# EAGLE design keyDuino v5 rev1 (EAGLE 7.4.0)
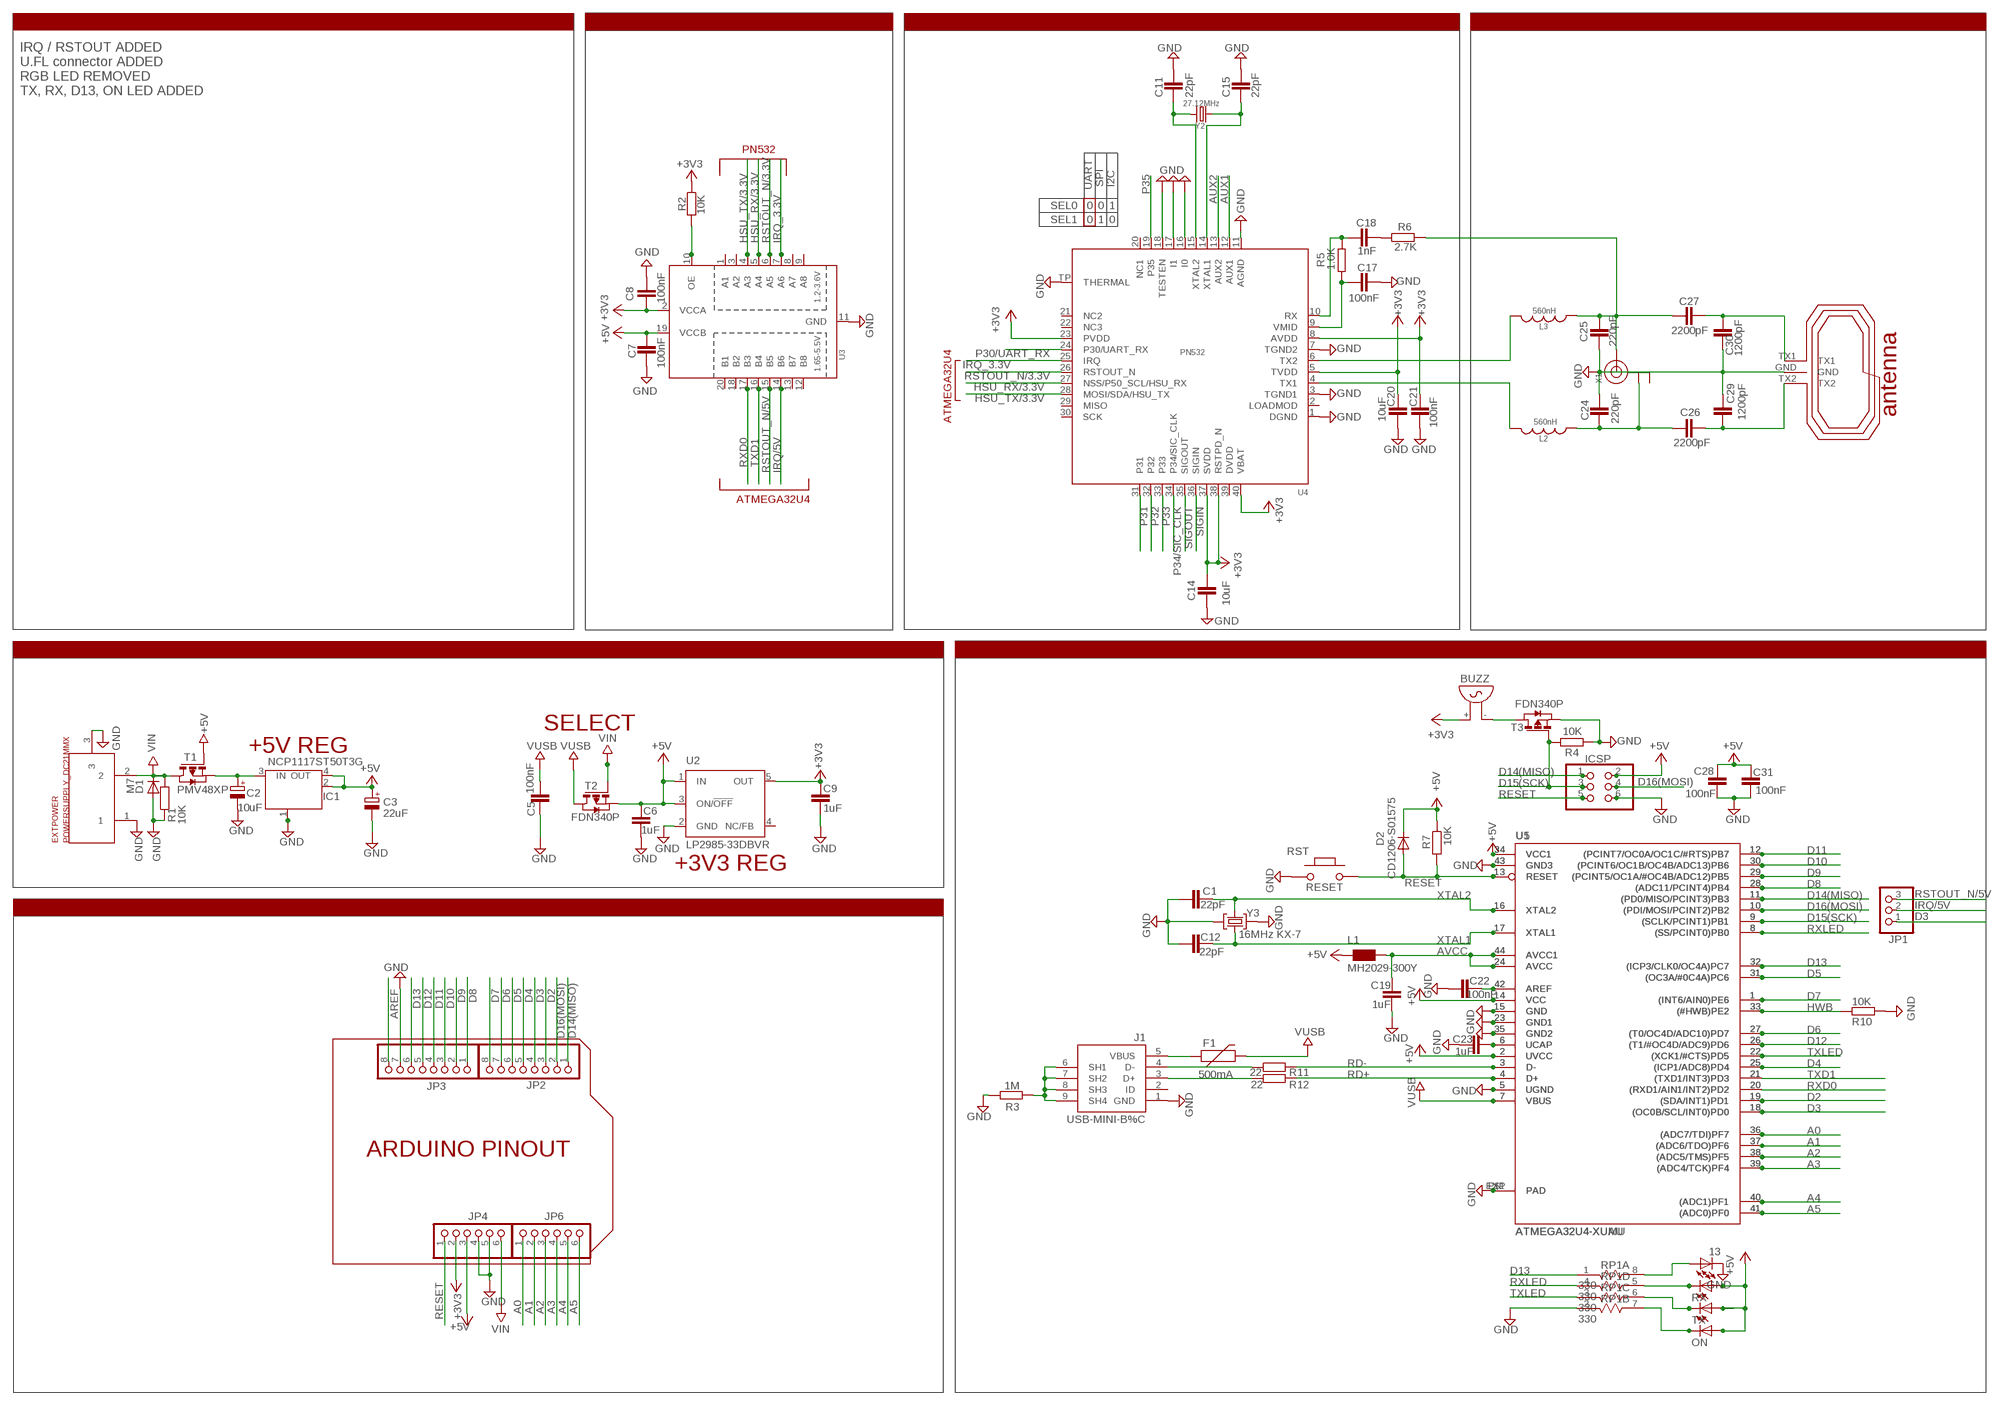
[diagram p0: schematic, sheet 1]

## Parts
13  LEDCHIPLED_0603  [CHIPLED_0603]
BUZZ  F/QMX  [F/QMX]
C1  22pF  CAP0603-CAP  [0603-CAP]
C2  10uF  CPOL-EUSMCB  [SMC_B]
C3  22uF  CPOL-EUSMCB  [SMC_B]
C5  100nF  C-EUC0603  [C0603]
C6  1uF  C-EUC0603  [C0603]
C7  100nF  C-EUC0603  [C0603]
C8  100nF  C-EUC0603  [C0603]
C9  1uF  C-EUC0603  [C0603]
C11  22pF  CAP0603-CAP  [0603-CAP]
C12  22pF  CAP0603-CAP  [0603-CAP]
C14  10uF  C-EUC0805  [C0805]
C15  22pF  CAP0603-CAP  [0603-CAP]
C17  100nF  C-EUC0603  [C0603]
C18  1nF  C-EUC0603  [C0603]
C19  1uF  C-EUC0603  [C0603]
C20  10uF  C-EUC0805  [C0805]
C21  100nF  C-EUC0805  [C0805]
C22  100nF  C-EUC0603  [C0603]
C23  1uF  C-EUC0603  [C0603]
C24  220pF  C-EUC0603  [C0603]
C25  220pF  C-EUC0603  [C0603]
C26  2200pF  C-EUC0603  [C0603]
C27  2200pF  C-EUC0603  [C0603]
C28  100nF  C-EUC0603  [C0603]
C29  1200pF  C-EUC0603  [C0603]
C30  1200pF  C-EUC0603  [C0603]
C31  100nF  C-EUC0603  [C0603]
D1  M7  DIODE-SMB  [SMB]
D2  CD1206-S01575  DIODE-MINIMELF  [MINIMELF]
EXTPOWER  POWERSUPPLY_DC21MMX  [POWERSUPPLY_DC-21MM]
F1  500mA  PTCSMD  [PTC-1206]
IC1  NCP1117ST50T3G  MC33269ST-3.3T3  [SOT223]
ICSP  ICSP  PINHD-2X3  [2X03]
J1  USB-MINI-B%C  [USB-MINI-B_2]
JP1  PINHD-1X3  [1X03]
JP2  PINHD-1X8CLEANBIG  [1X08-CLEANBIG]
JP3  PINHD-1X8CLEANBIG  [1X08-CLEANBIG]
JP4  PINHD-1X6CB  [1X06-CLEANBIG]
JP6  PINHD-1X6CB  [1X06-CLEANBIG]
L1  MH2029-300Y  WE-CBF_0805  [0805]
L2  560nH  INDUCTOR0805  [0805@1]
L3  560nH  INDUCTOR0805  [0805@1]
ON  LEDCHIPLED_0603  [CHIPLED_0603]
R1  10K  R-EU_R0603  [R0603]
R2  10K  R-EU_R0603  [R0603]
R3  1M  R-EU_R0805  [R0805]
R4  10K  R-EU_R0603  [R0603]
R5  1.0K  R-EU_R0603  [R0603]
R6  2.7K  R-EU_R0603  [R0603]
R7  10K  R-EU_R0603  [R0603]
R10  10K  R-EU_R0603  [R0603]
R11  22  R-EU_R0603  [R0603]
R12  22  R-EU_R0603  [R0603]
RP1  330  RES4NT  [RES4NT]
RST  RESET  PB157  [157SW]
RX  LEDCHIPLED_0603  [CHIPLED_0603]
T1  PMV48XP  PMOSSOT23  [SOT-23]
T2  FDN340P  PMOSSOT23  [SOT-23]
T3  FDN340P  PMOSSOT23  [SOT-23]
TX  LEDCHIPLED_0603  [CHIPLED_0603]
U1  ATMEGA32U4-XUAU  [TQFP44-PAD]
U2  LP2985-33DBVR  LP2985-XXDBVR33  [SOT23-DBV]
U3  TXB0108PWR  [TSSOP20]
U4  PN532  [HVQFN40-6X6]
U5  ATMEGA32U4-XUMU  [QFN44ML7X7]
U$1  ANT_V3  [ANT_13.56_P4]
X1  ANTENNA_U.FL  [U.FL]
Y2  27.12MHz  CRYSTALTHIN  [CRYSTAL_3.2X2.5]
Y3  16MHz KX-7  CRYSTAL-3.2-2.5  [CRYSTAL-3.2-2.5]

## Nets
+3V3: BUZZ.+ C8.1 C9.2 C14.2 C20.2 C21.2 JP4.2 R2.1 U2.5(OUT) U3.2(VCCA) U4.5(TVDD) U4.8(AVDD) U4.23(PVDD) U4.37(SVDD) U4.38(RSTPD_N) U4.40(VBAT)
+5V [usbvcc]: C3.+ C6.2 C7.2 C28.1 C31.1 D2.C IC1.2(OUT) IC1.4(OUT) ICSP.2 JP4.3 L1.1 ON.A R7.1 RX.A T1.3(G) T2.2(S) TX.A U1.2(UVCC) U1.14(VCC) U1.34(VCC1) U2.1(IN) U2.3(ON/!OFF) U3.19(VCCB) U5.2(UVCC) U5.14(VCC) U5.34(VCC1)
A0: JP6.1 U1.36((ADC7/TDI)PF7) U5.36((ADC7/TDI)PF7)
A1: JP6.2 U1.37((ADC6/TDO)PF6) U5.37((ADC6/TDO)PF6)
A2: JP6.3 U1.38((ADC5/TMS)PF5) U5.38((ADC5/TMS)PF5)
A3: JP6.4 U1.39((ADC4/TCK)PF4) U5.39((ADC4/TCK)PF4)
A4: JP6.5 U1.40((ADC1)PF1) U5.40((ADC1)PF1)
A5: JP6.6 U1.41((ADC0)PF0) U5.41((ADC0)PF0)
AREF [aref]: C22.1 JP3.8 U1.42(AREF) U5.42(AREF)
AUX1: U4.12(AUX1)
AUX2: U4.13(AUX2)
AVCC: C19.1 L1.2 U1.24(AVCC) U1.44(AVCC1) U5.24(AVCC) U5.44(AVCC1)
B1: 13.A RP1.8
CON1: C24.2 C26.1 L2.1 X1.1(GND)
D2: JP2.3 U1.19((SDA/INT1)PD1) U5.19((SDA/INT1)PD1)
D3: JP1.1 JP2.4 U1.18((OC0B/SCL/INT0)PD0) U5.18((OC0B/SCL/INT0)PD0)
D4: JP2.5 U1.25((ICP1/ADC8)PD4) U5.25((ICP1/ADC8)PD4)
D5: JP2.6 U1.31((OC3A/#0C4A)PC6) U5.31((OC3A/#0C4A)PC6)
D6: JP2.7 U1.27((T0/OC4D/ADC10)PD7) U5.27((T0/OC4D/ADC10)PD7)
D7: JP2.8 U1.1((INT6/AIN0)PE6) U5.1((INT6/AIN0)PE6)
D8: JP3.1 U1.28((ADC11/PCINT4)PB4) U5.28((ADC11/PCINT4)PB4)
D9: JP3.2 U1.29((PCINT5/OC1A/#OC4B/ADC12)PB5) U5.29((PCINT5/OC1A/#OC4B/ADC12)PB5)
D10: JP3.3 U1.30((PCINT6/OC1B/OC4B/ADC13)PB6) U5.30((PCINT6/OC1B/OC4B/ADC13)PB6)
D11: JP3.4 U1.12((PCINT7/OC0A/OC1C/#RTS)PB7) U5.12((PCINT7/OC0A/OC1C/#RTS)PB7)
D12: JP3.5 U1.26((T1/#OC4D/ADC9)PD6) U5.26((T1/#OC4D/ADC9)PD6)
D13: JP3.6 RP1.1 U1.32((ICP3/CLK0/OC4A)PC7) U5.32((ICP3/CLK0/OC4A)PC7)
D14(MISO): ICSP.1 JP2.1 U1.11((PD0/MISO/PCINT3)PB3) U5.11((PD0/MISO/PCINT3)PB3)
D15(SCK): ICSP.3 R4.1 T3.3(G) U1.9((SCLK/PCINT1)PB1) U5.9((SCLK/PCINT1)PB1)
D16(MOSI): ICSP.4 JP2.2 U1.10((PDI/MOSI/PCINT2)PB2) U5.10((PDI/MOSI/PCINT2)PB2)
G1: RP1.5 RX.C
GND [Ground]: 13.C C1.1 C2.- C3.- C5.1 C6.1 C7.1 C8.2 C9.1 C11.1 C12.1 C14.1 C15.1 C17.1 C19.2 C20.1 C21.1 C22.2 C23.2 C24.1 C25.2 C28.2 C29.1 C30.2 C31.2 D1.A EXTPOWER.1 EXTPOWER.3 IC1.1(GND/ADJ) ICSP.6 J1.1(GND) JP3.7 JP4.4 JP4.5 R1.1 R3.1 R4.2 R10.2 RP1.2 RST.1 T3.2(S) U1.5(UGND) U1.15(GND) U1.23(GND1) U1.35(GND2) U1.43(GND3) U1.P$1(PAD) U2.2(GND) U3.11(GND) U4.1(DGND) U4.3(TGND1) U4.7(TGND2) U4.11(AGND) U4.16(I0) U4.17(I1) U4.18(TESTEN) U4.TP(THERMAL) U5.5(UGND) U5.15(GND) U5.23(GND1) U5.35(GND2) U5.43(GND3) U5.EXP(PAD) U$1.GND Y3.2(GND) Y3.4(GND)
HSU_RX/3.3V: U3.5(A4) U4.27(NSS/P50_SCL/HSU_RX)
HSU_TX/3.3V: U3.4(A3) U4.28(MOSI/SDA/HSU_TX)
HWB: R10.1 U1.33((#HWB)PE2) U5.33((#HWB)PE2)
IRQ/5V: JP1.2 U3.14(B6)
IRQ_3.3V: U3.7(A6) U4.25(IRQ)
N$1: BUZZ.- T3.1(D)
N$3: F1.1 J1.5(VBUS)
N$4: J1.6(SH1) J1.7(SH2) J1.8(SH3) J1.9(SH4) R3.2
N$8: C18.1 R6.1
N$9: L2.2 U4.4(TX1)
N$10: L3.2 U4.6(TX2)
N$11: ON.C RP1.7
N$14: J1.4(D-) R11.1
N$16: J1.3(D+) R12.1
N$21: C2.+ IC1.3(IN) T1.2(S)
N$23: R2.2 U3.10(OE)
N$47: C15.2 U4.14(XTAL1) Y2.1
N$48: C11.2 U4.15(XTAL2) Y2.2
N$49: C17.2 R5.2 U4.9(VMID)
N$50: C18.2 R5.1 U4.10(RX)
P30/UART_RX: U4.24(P30/UART_RX)
P31: U4.31
P32: U4.32
P33: U4.33
P34/SIC_CLK: U4.34(P34/SIC_CLK)
P35: U4.19(P35)
R1: RP1.6 TX.C
RD+: R12.2 U1.4(D+) U5.4(D+)
RD-: R11.2 U1.3(D-) U5.3(D-)
RESET: D2.A ICSP.5 JP4.1 R7.2 RST.2 U1.13(RESET) U5.13(RESET)
RSTOUT_N/3.3V: U3.6(A5) U4.26(RSTOUT_N)
RSTOUT_N/5V: JP1.3 U3.15(B5)
RXD0: U1.20((RXD1/AIN1/INT2)PD2) U3.17(B3) U5.20((RXD1/AIN1/INT2)PD2)
RXLED: RP1.4 U1.8((SS/PCINT0)PB0) U5.8((SS/PCINT0)PB0)
SIGIN: U4.36(SIGIN)
SIGOUT: U4.35(SIGOUT)
TX1_ANTENNA: C26.2 C29.2 U$1.TX2
TX2_ANTENNA: C27.1 C30.1 U$1.TX1
TXD1: U1.21((TXD1/INT3)PD3) U3.16(B4) U5.21((TXD1/INT3)PD3)
TXLED: RP1.3 U1.22((XCK1/#CTS)PD5) U5.22((XCK1/#CTS)PD5)
UCAP: C23.1 U1.6(UCAP) U5.6(UCAP)
VIN [usbvcc]: D1.C EXTPOWER.2 JP4.6 R1.2 T1.1(D) T2.3(G)
VUSB [usbvcc]: C5.2 F1.2 T2.1(D) U1.7(VBUS) U5.7(VBUS)
XTAL1: C12.2 U1.17(XTAL1) U5.17(XTAL1) Y3.1(C1)
XTAL2: C1.2 U1.16(XTAL2) U5.16(XTAL2) Y3.3(C2)
XX1: C25.1 C27.2 L3.1 R6.2 X1.3(SIGNAL)
Unconnected: J1.2(ID) U2.4(NC/FB) U3.1(A1) U3.3(A2) U3.8(A7) U3.9(A8) U3.12(B8) U3.13(B7) U3.18(B2) U3.20(B1) U4.2(LOADMOD) U4.20(NC1) U4.21(NC2) U4.22(NC3) U4.29(MISO) U4.30(SCK) U4.39(DVDD) U$1.P$4 U$1.P$5 U$1.P$6 U$1.P$7 U$1.P$8 U$1.P$9 U$1.P$10 U$1.P$11 X1.2(GND)

## Notes on the sheet
- MOD | convertisseur de niveau | PN532 | ACCORDING CIRCUIT
- IRQ / RSTOUT ADDED
  U.FL connector ADDED
  RGB LED REMOVED
  TX, RX, D13, ON LED ADDED
- PN532
- UART | SPI | I2C
- SEL0 | 0 | 0 | 1
- SEL1 | 0 | 1 | 0
- ATMEGA32U4
- ATMEGA32U4
- SUPPLYs | ATMEGA32U4
- SELECT
- +5V REG
- +3V3 REG
- PINOUT
- ARDUINO PINOUT

## Library data of the parts
13 ON RX TX = adafruit:LED: LED OSRAM: - CHIPLED LG R971, LG N971, LY N971, LG Q971, LY Q971, LO R971, LY R971 LH N974, LH R974 LS Q976, LO Q976, LY Q976 LO Q996 - Hyper CHIPLED LW Q18S LB Q993, LB Q99A, LB R99A - SideLED LS A670, LO A670, LY A670, LG A670, LP A670 LB A673, LV A673, LT A673, LW A673 LH A674 LY A675 LS A676, LA A676, LO A676, LY A676, LW A676 LS A679, LY A679, LG A679 - Hyper Micro SIDELED® LS Y876, LA Y876, LO Y876, LY Y876 LT Y87S - SmartLED LW L88C, LW L88S LB L89C, LB L89S, LG L890 LS L89K, LO L89K, LY L89K LS L896, LA L896, LO L896, LY L896 - TOPLED LS T670, LO T670, LY T670, LG T670, LP T670 LSG T670, LSP T670, LSY T670, LOP T670, LYG T670 LG T671, LOG T671, LSG T671 LB T673, LV T673, LT T673, LW T673 LH T674 LS T676, LA T676, LO T676, LY T676, LB T676, LH T676, LSB T676, LW T676 LB T67C, LV T67C, LT T67C, LS T67K, LO T67K, LY T67K, LW E67C LS E67B, LA E67B, LO E67B, LY E67B, LB E67C, LV E67C, LT E67C LW T67C LS T679, LY T679, LG T679 LS T770, LO T770, LY T770, LG T770, LP T770 LB T773, LV T773, LT T773, LW T773 LH T774 LS E675, LA E675, LY E675, LS T675 LS T776, LA T776, LO T776, LY T776, LB T776 LHGB T686 LT T68C, LB T68C - Hyper Mini TOPLED® LB M676 - Mini TOPLED Santana® LG M470 LS M47K, LO M47K, LY M47K Source: http://www.osram.convergy.de/
BUZZ = buzzer:F/QMX: BUZZER Source: Buerklin; OC_FARNELL: unknown; OC_NEWARK: unknown
C1 C11 C12 C15 = SparkFun:CAP: Capacitor Standard 0603 ceramic capacitor, and 0.1" leaded capacitor.
C2 C3 = rcl:CPOL-EU: POLARIZED CAPACITOR, European symbol
C5 C19 C22 C23 C28 C31 = resistor:C-EU: CAPACITOR, European symbol
C6-C9 C14 C17 C18 C20 C21 C24-C27 C29 C30 = rcl:C-EU: CAPACITOR, European symbol
D1 D2 = diode:DIODE-: DIODE
EXTPOWER = SmartPrj:POWERSUPPLY_DC21MM
F1 = SparkFun:PTC: Resettable Fuse PTC Resettable Fuse. Spark Fun Electronics SKU : COM-08357
IC1 = linear:MC33269ST*: Adjustable Output Low Dropout Voltage Regulator 800 mA Source: http://www.onsemi.com/pub/Collateral/MC33269-D.PDF
ICSP = SmartPrj:PINHD-2X3: PIN HEADER
J1 = MyCON2:USB-MINI-B
JP1 = adafruit:PINHD-1X3: PIN HEADER
JP2 JP3 = adafruit:PINHD-1X8: PIN HEADER
JP4 JP6 = adafruit:PINHD-1X6: PIN HEADER
L1 = wuerth-elektronik:WE-CBF: SMD EMI Suppression Ferrite Beads - excellent anti-EMI properties - low DCR - impedances till 3000 ohms - rated current up to 6 A
L2 L3 = microbuilder:INDUCTOR: Inductors 0603: 10nH Ceramic Inductor - microwire antenna/RF (Digikey: 712-1434-2-ND) 0805: 560nH Ceramic Inductor - RF (Digikey: 553-1047-1-ND) 1007 (2518 Metric) SMT: 10µH 10% 250mOhm 820mA 1007 Inductor (Digikey: 587-2189-1-ND) 22µH 10% 500mOhm 580mA 1007 Inductor (Digikey: 587-2190-1-ND) 47µH 10% 950mOhm 420mA 1007 Inductor (Digikey: 587-2191-1-ND) 47µH 5% 100mOhm 1A 1008 Inductor (Digikey: 732-1816-1-ND)
R1 = resistor:R-EU_: RESISTOR, European symbol
R2-R7 R10-R12 = rcl:R-EU_: RESISTOR, European symbol
RP1 = MySMD:RES4NT
RST = MySMD:PB157
T1-T3 = zetex:PMOSSOT23: MOS FET
U1 U5 = SmartPrj:ATMEGA32U4-XU
U2 = SmartPrj:LP2985-XXDBVR: ULTRALOW-POWER 50-mA LOW-DROPOUT LINEAR REGULATORS 50-mA Low-Dropout Regulator Source: http://focus.ti.com/lit/ds/symlink/tps77001.pdf
U3 = adafruit:TXB0108PWR: 8-Bit Bi-Directional Level Shifter 1.2V-3.6V (VCCA) to 1.65V-5.5V (VCCB) bi-directional level shifter with auto direction sensing. Max data rate - VCCA 1.8V: 20Mbps (50ns), VCCA 3.3V: 100Mbps (10ns) Digikey: 296-21527-1-ND
U4 = microbuilder:PN532: PN532 - Near Field Communication (NFC) controller Highly integrated transceiver module for contactless communication at 13.56 MHz (14443A/MIFARE, FeliCa, I4443B)
U$1 = CITC_ANTENNE:ANT_V3
X1 = adafruit:ANTENNA_U.FL: U.FL Antenna Connector
Y2 = microbuilder:CRYSTAL: Crystals HC49UP - Surface Mount Crystal 4.0MHz 18pF +/-30ppm Surface Mount Crystal [Digikey: 535-9857-1-ND] 12.0 MHz Surface Mount Crystal [Digikey: 535-9869-6-ND] 25.0 MHz Surface Mount Crystal [Digikey: 535-9078-1-ND] 3.2 x 2.5mm - MEMs SMT Crystal 12.0 MHz 8pF 15ppm 3.2 x 2.5mm Crystal [Digikey: 644-1047-1-ND] 16.0 MHz 8pF 15ppm 3.2 x 2.5mm Crystal [Digikey: 644-1049-1-ND] 16.0 MHz 10pF 10ppm 3.2 x 2.5mm Crystal [Digikey: 644-1100-1-ND] 27.12 MHz 18pF 30ppm 3.2 x 2.5mm Crystal [Digikey: 887-1424-1-ND] 4.9 x 1.8mm - MEMs SMT Crystal 32.768 KHz 12.5pF 20ppm 4.9 x 1.8mm Crystal [Digikey: SE2415CT-ND] Cylinder 32.768KHz Cylinder Crystal
Y3 = SmartPrj:CRYSTAL-3.2-2.5

## Net classes
1 Ground: width 0.61 mm, clearance 0.254 mm
2 +3v3: width 0.61 mm, clearance 0.254 mm
3 usbvcc: width 0.254 mm, drill 0.61 mm, clearance 0.254 mm
4 aref: width 0.254 mm, drill 0.61 mm, clearance 0.254 mm

## Board
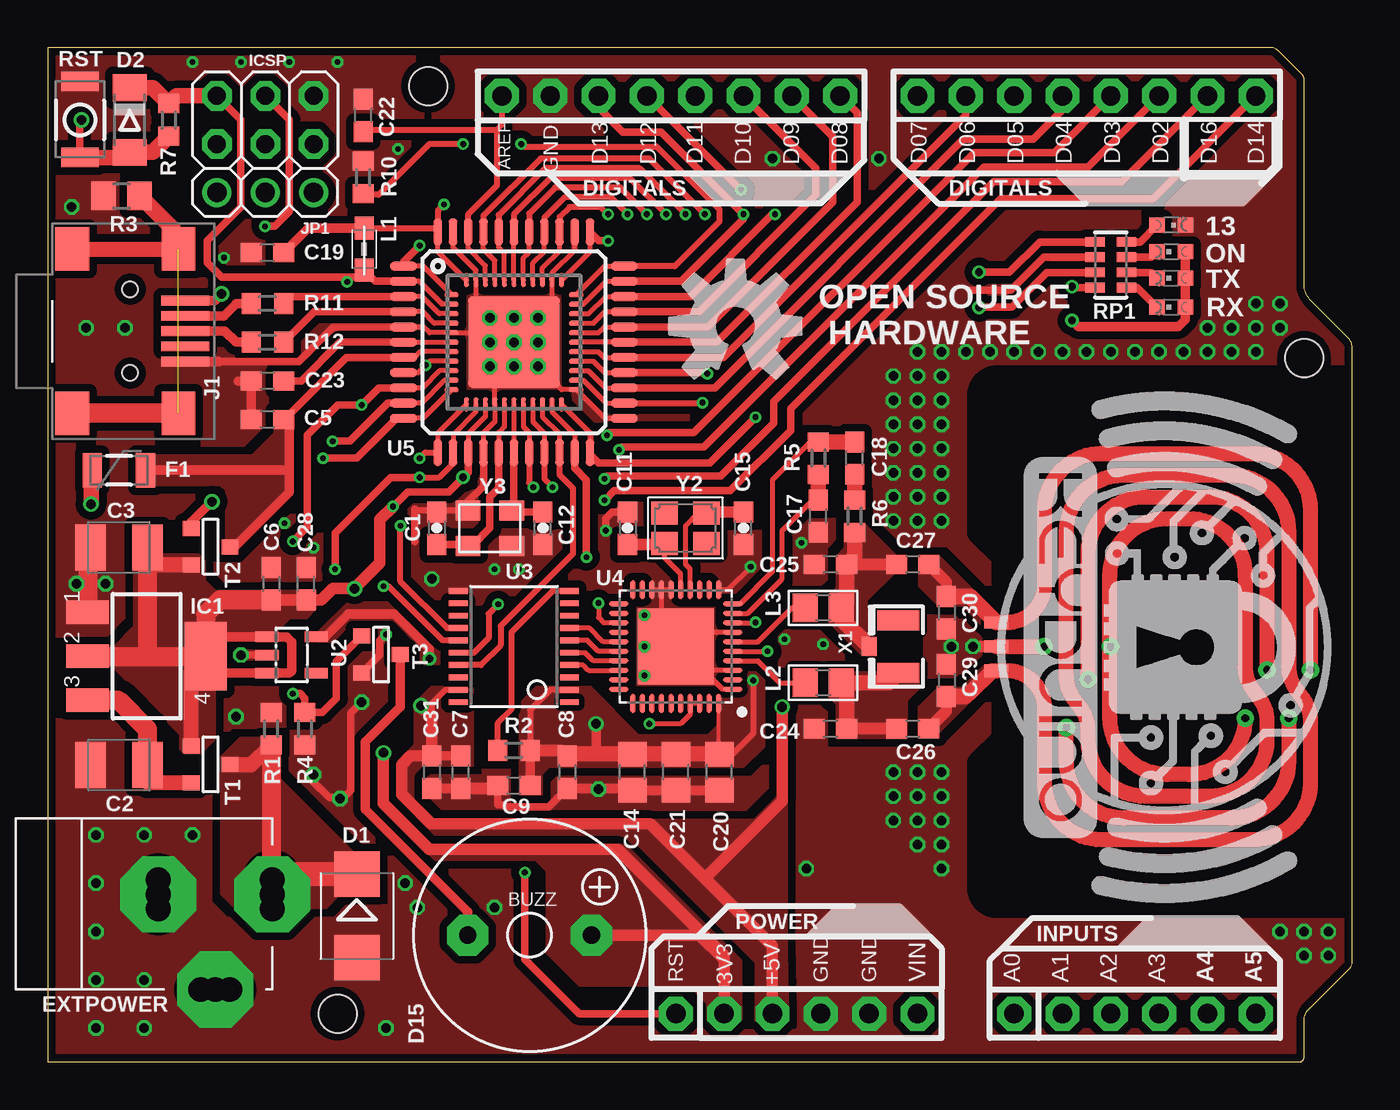
[diagram p1: board, top side]
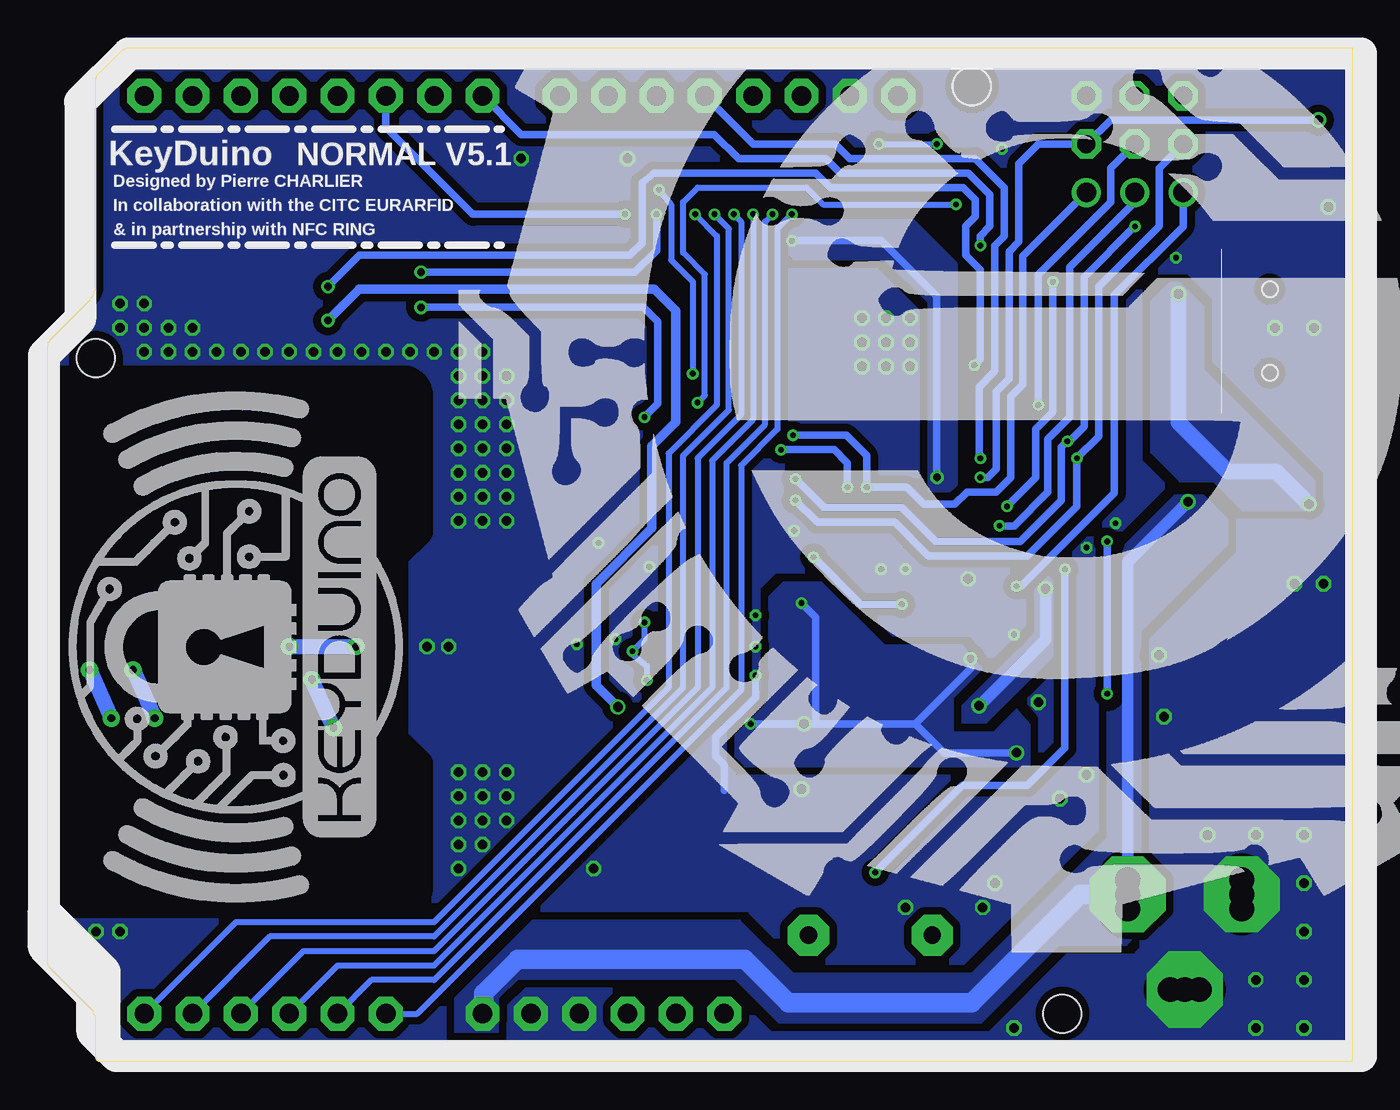
[diagram p2: board, bottom side, seen from below]

Size 68.58 x 53.34 mm. Coordinates in mm from the lower left corner, seen from the top.
Outline: 0,0 65.79,0 arc90 66.04,0.25 66.04,2.21 arc-45 66.28,2.78 68.43,4.93 arc45 68.58,5.29 68.58,37.51 arc45 68.34,38.08 66.42,40.01 arc-45 66.04,40.92 66.04,51.67 arc45 65.93,51.92 64.68,53.17 arc45 64.28,53.34 0,53.34 0,0
Copper layers (1*16): Top 0.035mm / dielectric 1.5mm / Bottom 0.035mm
Design rules "Elecrow_2-layer_eagle_rule": minimum track width 6mil, minimum drill 12mil, track to track 6mil, track to pad 6mil, pad to pad 6mil, via to via 6mil, smd to smd 0mil, copper to edge 10mil, drill to drill 10mil, minimum pad ring 10mil, minimum via ring 6mil, stop-mask expansion 2mil, vias tented up to drill 100mil, thermal gap 10mil
Holes 2 mm at 15.24,2.54 66.04,37.02 20,51.31
tRestrict: area 48.9,8.1 to 68.6,36.1
bRestrict: area 48.9,8.1 to 68.6,36.1

### Footprints (pad centres in the part's own frame; a part is rotated, then mirrored left to right if it is on the bottom)
CHIPLED_0603 = smd 0.8 x 0.8: A 0,-0.75; C 0,0.75
F/QMX = drill 0.914 pad 2.159 octagon: + 3.251,0; - -3.251,0
0603-CAP = smd 1.1 x 1: 1 -0.85,0; 2 0.85,0
SMC_B = smd 1.6 x 2.4: + -1.5,0; - 1.5,0
C0603 = smd 1.1 x 1: 1 -0.85,0; 2 0.85,0
C0805 = smd 1.3 x 1.5: 1 -0.95,0; 2 0.95,0
SMB = smd 2.4 x 2.4: A 2.2,0; C -2.2,0
MINIMELF = smd 1.4 x 1.8: A 1.7,0; C -1.7,0
POWERSUPPLY_DC-21MM = drill 1.3 pad 4 octagon: 1 -5.08,-3.353; 2 -0.076,-6.35; 3 -0.076,-0.356 | drill 1.3: 4 -5.08,-4.115; 5 -5.08,-2.591; 6 -0.838,-0.356; 7 0.686,-0.356; 8 -0.838,-6.35; 9 0.686,-6.35
PTC-1206 = smd 1 x 1.8: 1 -1.4,0; 2 1.4,0
SOT223 = smd 1.219 x 2.235: 1 -2.311,-3.099; 2 0,-3.099; 3 2.311,-3.099 | smd 3.6 x 2.2: 4 0,3.099
2X03 = drill 0.95 pad 1.55 octagon: 1 -2.54,-1.27; 2 -2.54,1.27; 3 0,-1.27; 4 0,1.27; 5 2.54,-1.27; 6 2.54,1.27
USB-MINI-B_2 = smd 0.508 x 2.54: 1 0,0; 2 0.8,0; 3 1.6,0; 4 2.4,0; 5 3.2,0 | smd 2.286 x 1.778: 6 -2.717,5.948; 7 -2.717,0.36; 8 5.918,0.36; 9 5.918,5.948 | hole 0.813: -0.6,2.9; 3.8,2.9
1X03 = drill 1.016: 1 -2.54,0; 2 0,0; 3 2.54,0
1X08-CLEANBIG = drill 1.016 pad 1.778 octagon: 1 -8.89,0; 2 -6.35,0; 3 -3.81,0; 4 -1.27,0; 5 1.27,0; 6 3.81,0; 7 6.35,0; 8 8.89,0
1X06-CLEANBIG = drill 1.016 pad 1.778 octagon: 1 -6.35,0; 2 -3.81,0; 3 -1.27,0; 4 1.27,0; 5 3.81,0; 6 6.35,0
0805 = smd 1.2 x 1: 1 -1.1,0; 2 1.1,0
0805@1 = smd 1.3 x 1.5: 1 -0.95,0; 2 0.95,0
R0603 = smd 1 x 1.1: 1 -0.85,0; 2 0.85,0
R0805 = smd 1.3 x 1.5: 1 -0.95,0; 2 0.95,0
RES4NT = smd 0.508 x 1.016: 1 0,0; 2 0.8,0; 3 1.6,0; 4 2.4,0; 5 2.4,1.651; 6 1.6,1.651; 7 0.8,1.651; 8 0,1.651
157SW = smd 1.016 x 1.981: 1 0,0; 2 4,0
SOT-23 = smd 0.787 x 0.889: 1 0.025,-1.016; 2 -0.94,1.016; 3 0.991,1.016
TQFP44-PAD = smd 1.4 x 0.45: 1 -5.8,4; 2 -5.8,3.2; 3 -5.8,2.4; 4 -5.8,1.6; 5 -5.8,0.8; 6 -5.8,0; 7 -5.8,-0.8; 8 -5.8,-1.6; 9 -5.8,-2.4; 10 -5.8,-3.2; 11 -5.8,-4; 23 5.8,-4; 24 5.8,-3.2; 25 5.8,-2.4; 26 5.8,-1.6; 27 5.8,-0.8; 28 5.8,0; 29 5.8,0.8; 30 5.8,1.6; 31 5.8,2.4; 32 5.8,3.2; 33 5.8,4 | smd 0.45 x 1.4: 12 -4,-5.8; 13 -3.2,-5.8; 14 -2.4,-5.8; 15 -1.6,-5.8; 16 -0.8,-5.8; 17 0,-5.8; 18 0.8,-5.8; 19 1.6,-5.8; 20 2.4,-5.8; 21 3.2,-5.8; 22 4,-5.8; 34 4,5.8; 35 3.2,5.8; 36 2.4,5.8; 37 1.6,5.8; 38 0.8,5.8; 39 0,5.8; 40 -0.8,5.8; 41 -1.6,5.8; 42 -2.4,5.8; 43 -3.2,5.8; 44 -4,5.8 | smd 1 x 1: P$1 0,0
SOT23-DBV = smd 0.55 x 1.2: 1 -0.95,-1.3; 2 0,-1.3; 3 0.95,-1.3; 4 0.95,1.3; 5 -0.95,1.3
TSSOP20 = smd 0.305 x 0.991: 1 -2.925,-2.918; 2 -2.275,-2.918; 3 -1.625,-2.918; 4 -0.975,-2.918; 5 -0.325,-2.918; 6 0.325,-2.918; 7 0.975,-2.918; 8 1.625,-2.918; 9 2.275,-2.918; 10 2.925,-2.918; 11 2.925,2.918; 12 2.275,2.918; 13 1.625,2.918; 14 0.975,2.918; 15 0.325,2.918; 16 -0.325,2.918; 17 -0.975,2.918; 18 -1.625,2.918; 19 -2.275,2.918; 20 -2.925,2.918
HVQFN40-6X6 = smd 1 x 0.25: 1 -2.99,2.25; 2 -2.99,1.75; 3 -2.99,1.25; 4 -2.99,0.75; 5 -2.99,0.25; 6 -2.99,-0.25; 7 -2.99,-0.75; 8 -2.99,-1.25; 9 -2.99,-1.75; 10 -2.99,-2.25; 21 2.99,-2.25; 22 2.99,-1.75; 23 2.99,-1.25; 24 2.99,-0.75; 25 2.99,-0.25; 26 2.99,0.25; 27 2.99,0.75; 28 2.99,1.25; 29 2.99,1.75; 30 2.99,2.25 | smd 0.25 x 1: 11 -2.25,-2.99; 12 -1.75,-2.99; 13 -1.25,-2.99; 14 -0.75,-2.99; 15 -0.25,-2.99; 16 0.25,-2.99; 17 0.75,-2.99; 18 1.25,-2.99; 19 1.75,-2.99; 20 2.25,-2.99; 31 2.25,2.99; 32 1.75,2.99; 33 1.25,2.99; 34 0.75,2.99; 35 0.25,2.99; 36 -0.25,2.99; 37 -0.75,2.99; 38 -1.25,2.99; 39 -1.75,2.99; 40 -2.25,2.99 | smd 4 x 4: TP 0,0
QFN44ML7X7 = smd 0.75 x 0.275: 1 -3.275,2.5; 2 -3.275,2; 3 -3.275,1.5; 4 -3.275,1; 5 -3.275,0.5; 6 -3.275,0; 7 -3.275,-0.5; 8 -3.275,-1; 9 -3.275,-1.5; 10 -3.275,-2; 11 -3.275,-2.5; 23 3.275,-2.5; 24 3.275,-2; 25 3.275,-1.5; 26 3.275,-1; 27 3.275,-0.5; 28 3.275,0; 29 3.275,0.5; 30 3.275,1; 31 3.275,1.5; 32 3.275,2; 33 3.275,2.5 | smd 0.275 x 0.75: 12 -2.5,-3.275; 13 -2,-3.275; 14 -1.5,-3.275; 15 -1,-3.275; 16 -0.5,-3.275; 17 0,-3.275; 18 0.5,-3.275; 19 1,-3.275; 20 1.5,-3.275; 21 2,-3.275; 22 2.5,-3.275; 34 2.5,3.275; 35 2,3.275; 36 1.5,3.275; 37 1,3.275; 38 0.5,3.275; 39 0,3.275; 40 -0.5,3.275; 41 -1,3.275; 42 -1.5,3.275; 43 -2,3.275; 44 -2.5,3.275 | smd 4.826 x 4.826: EXP 0,0
ANT_13.56_P4 = smd 0.635 x 1.27: GND 0,-9; TX1 -1.27,-9; TX2 1.27,-9 | drill 0.4 pad 0.813: P$4 1.23,7.51; P$5 3.77,6.367; P$6 1.23,5.224; P$7 3.77,4.081; P$8 1.73,-4.174; P$9 4.27,-5.317; P$10 0,-3; P$11 0,-6.5
U.FL = smd 2.2 x 1.05: 1 0,1.375; 2 0,-1.375 | smd 0.8 x 1: 3 1.525,0
CRYSTAL_3.2X2.5 = smd 1.4 x 1.2: 1 -1.1,-0.8; 2 1.1,0.8; GND1 -1.1,0.8; GND2 1.1,-0.8
CRYSTAL-3.2-2.5 = smd 1.3 x 1.05: 1 -1.15,-0.925; 2 1.15,-0.925; 3 1.15,0.925; 4 -1.15,0.925

### Placement (x,y rotation side)
13  59.06,44.01 270 top
BUZZ  25.34,6.67 0 top
C1  20.45,28.07 270 top
C2  3.75,15.62 180 top
C3  3.75,27.05 180 top
C5  11.56,33.78 0 top
C6  11.75,25.15 270 top
C7  21.72,15.24 90 top
C8  27.31,15.24 270 top
C9  24.51,14.54 0 top
C11  30.48,28.07 270 top
C12  26.03,28.07 90 top
C14  30.73,15.24 90 top
C15  36.58,28.07 90 top
C17  40.51,28.7 90 top
C18  42.42,31.75 90 top
C19  11.56,42.55 180 top
C20  35.31,15.24 90 top
C21  33.02,15.24 90 top
C22  16.6,49.78 90 top
C23  11.56,35.81 180 top
C24  41.15,17.53 0 top
C25  41.15,26.16 180 top
C26  45.47,17.53 0 top
C27  45.47,26.16 180 top
C28  13.59,25.15 90 top
C29  47.24,20.07 270 top
C30  47.24,23.62 270 top
C31  20.19,15.24 270 top
D1  16.26,7.68 270 top
D2  4.32,49.53 270 top
EXTPOWER  5.46,8.89 90 top
F1  3.75,31.11 0 top
IC1  5.21,21.34 270 top
ICSP  11.44,49.53 0 top
J1  7.24,36.83 90 top
JP1  11.44,45.72 180 top
JP2  54.61,50.8 180 top
JP3  32.77,50.8 180 top
JP4  39.37,2.54 0 top
JP6  57.15,2.54 0 top
L1  16.64,42.74 90 top
L2  40.77,19.94 180 top
L3  40.77,23.88 180 top
ON  59.06,42.61 90 top
R1  11.75,17.53 270 top
R2  24.51,16.38 180 top
R3  3.89,45.54 0 top
R4  13.53,17.53 270 top
R5  40.51,31.75 270 top
R6  42.42,28.7 270 top
R7  6.38,49.53 270 top
R10  16.59,46.51 90 top
R11  11.56,39.88 0 top
R12  11.56,37.85 0 top
RP1  55.05,43.12 270 top
RST  1.7,51.56 270 top
RX  59.06,39.69 90 top
T1  8.57,15.62 90 top
T2  8.57,27.06 90 top
T3  17.53,21.4 90 top
TX  59.06,41.21 90 top
U1  24.51,37.85 0 top
U2  12.83,21.4 270 top
U3  24.51,21.84 90 top
U4  33.02,21.84 180 top
U5  24.51,37.85 0 top
U$1  58.86,21.84 270 top
U$2  [OSHW-LOGO-L]  36.15,38.69 0 top
X1  44.7,21.84 180 top
Y2  33.53,28.07 180 top
Y3  23.24,28.07 180 top

### Tracks (layer width: path | path; a pad name or v marks a point on that pad's centre or on a via)
+3V3  (via drill 0.3, 0.4, 0.5)
  Top 0.2: C20.2 35.27,15.98 U4.40
  Top 0.254: U4.23 29.23,23.09 28.96,23.37 v28.96,24.13 | v31.62,17.78 33.27,17.78 33.77,18.27 U4.37 U4.38 | U4.5 v37.84,21.59 v37.85,21.59 | U4.8 37.32,23.09 v37.21,23.11
  Top 0.305: U3.2 26.43,19.57 25.36,18.5 R2.1 | v37.08,20.07 37.08,17.27 36,16.19 C20.2 | v37.85,21.59 37.97,21.59 | C8.1 27.31,16.19 27.41,16.19
  Top 0.5: C9.2 R2.1 | C8.1 27.14,16 | v28.83,17.78 28.83,16.19 | v20.07,21.21 20.07,21.72 18.22,23.56 15.81,23.56 14.6,22.35 U2.5
  Top 0.61: 35.56,5.4 35.56,5.59 29.97,11.18 20.07,11.18 17.65,13.59 v17.65,16.26 | R2.1 27.01,16.38 C8.1 | BUZZ.+ 34.29,6.67 35.56,5.4 | JP4.2 35.56,5.4
  Top 0.813: 27.41,16.19 28.83,16.19 C14.2 C21.2 C20.2
  Bottom 0.305: v37.08,20.07 37.08,20.83 37.72,21.34 37.97,21.6 v37.84,21.59 37.21,22.22 v37.21,23.11
  Bottom 0.406: 22.99,17.78 28.19,17.78 | 28.19,17.78 v28.83,17.78 v31.62,17.78 | v28.96,24.13 28.19,23.37 28.19,17.78 | v20.07,21.21 20.07,20.7 22.99,17.78 | v17.65,16.26 21.46,16.26 22.99,17.78
  pour Top (isolate 0.305, no thermals): 24.83,14.03 24.83,18.86 25.72,19.75 28.51,19.75 31.05,17.21 34.73,17.21 35.24,17.72 35.24,19.18 35.31,20.51 37.34,20.51 37.66,20.19 37.66,16.57 36.58,15.49 26.35,15.49 25.97,15.11 25.97,14.03
  pour Top (isolate 0.305, no thermals): 34.67,2.22 34.67,3.05 33.72,4 27.94,4 26.23,5.72 26.23,10.03 25.65,10.6 20.38,10.6 19.62,11.37 20.19,11.43 30.35,11.43 36.45,5.33 36.45,2.22
  pour Top (isolate 0.406, no thermals): 14.16,22.54 15.81,24.19 18.54,24.19 20.57,22.16 20.57,20.89 19.81,20.89 19.62,21.08 19.62,21.78 18.16,23.24 16.13,23.24 14.99,22.1 14.16,22.1
  pour Bottom (isolate 0.406, rank 2, no thermals): 16.95,15.56 16.95,17.72 20.51,21.91 24.57,21.91 27.88,25.21 29.91,25.21 30.67,24.45 30.67,19.11 32.45,17.34 32.45,16.07 31.94,15.56
+5V  (via drill 0.3, 0.4, 0.5)
  Top 0.254: U5.14 23.01,33.93 22.11,33.03 U1.14 | U5.34 28.51,42.62 U1.34 | U5.2 20.73,39.85 19.53,41.05 U1.2
  Top 0.305: U3.19 20.9,19.57 20.19,18.86 C31.1
  Top 0.406: U1.34 28.98,43.18 v29.46,43.18 | 22.1,32.03 U1.14 22.11,31 v21.84,30.73 21.08,29.97 18.92,29.97 v18.16,29.21 | ICSP.2 10.16,49.54 10.16,44.96 8.38,43.18 8.38,42.04 9.14,41.28 16.28,41.28 L1.1 | U1.2 17.23,41.05 17.01,41.26 | 17.01,41.26 L1.1 | 16.62,41.64 L1.1 | v15.75,41.02 15.99,41.26 17.01,41.26
  Top 0.5: C31.1 C7.2 | ON.A TX.A RX.A 59.81,39.04 59.44,38.67 54.17,38.67 v53.85,38.99 | 8.7,21.78 9.27,22.35 U2.1 12.58,22.35 12.83,22.1 12.83,20.57 12.7,20.45 U2.3 9.19,20.45 IC1.4
  Top 0.61: C6.2 C28.1 14.39,24.3 14.99,24.89 v16.13,24.89 17.46,26.23 17.46,28.51 v18.16,29.21 | JP4.3 38.1,6.1 34.54,9.65 | 34.54,9.65 31.69,12.51 20.16,12.51 18.61,14.07 18.61,15.63 19.07,16.09 C31.1 20.19,18.16 v19.62,18.73 | v38.61,18.67 38.61,13.72 34.54,9.65
  Top 0.8: T2.2 5.25,26.12 C3.+ | T1.3 7.56,20.59 IC1.4
  Top 0.813: D2.C 5.53,51.23 R7.1 6.8,50.8 ICSP.2
  Top 1: IC1.2 4.95,21.34 | 4.95,21.34 IC1.4 8.31,23.55 9.06,24.3 C6.2 | C3.+ 5.25,21.63 arc-90 4.95,21.34
  Bottom 0.406: v15.75,41.02 15.75,34.16 16.64,33.27 16.64,30.73 v18.16,29.21 | v29.46,43.18 24.76,43.18 21.84,40.26 v21.84,30.73
  Bottom 0.5: v38.61,18.67 39.75,19.81 39.75,25.15 36.83,28.07 36.83,32.39 35.56,33.66 35.56,39.5 36.7,40.64 52.2,40.64 v53.85,38.99
  Bottom 0.61: v16.13,24.89 16.13,22.22 v19.62,18.73
  pour Top (isolate 0.61, no thermals): 1.08,21.91 3.49,21.91 4.51,22.92 4.51,26.48 4.76,26.73 7.94,26.73 8.32,26.35 8.32,25.34 8.83,24.83 14.16,24.83 14.16,23.81 13.65,23.3 12.76,23.3 11.62,22.16 8.83,22.16 8.83,16.95 8.06,16.19 7.18,16.19 6.92,16.45 6.92,17.21 3.37,20.76 1.08,20.76
  pour Top (isolate 0.406, no thermals): 37.21,2.16 37.21,5.21 30.99,11.43 20.7,11.43 18.45,13.72 18.41,15.8 19.3,16.7 19.3,18.86 20.19,19.75 22.22,19.75 22.35,19.62 22.35,15.56 19.69,15.56 19.43,15.3 19.43,13.65 20.32,12.76 37.15,12.76 38.29,13.91 38.86,13.91 38.86,5.84 38.93,2.22 38.86,2.16
  pour Bottom (isolate 0.406, no thermals): 15.68,25.21 15.94,25.46 16.45,25.46 16.7,25.21 16.7,22.54 20.51,18.73 20.51,17.84 19.24,17.84 15.68,21.4
  pour Bottom (isolate 0.406, no thermals): 22.29,29.78 21.27,29.78 20.76,30.29 20.76,41.97 23.05,44.26 29.15,44.26 29.91,43.5 29.91,42.74 29.4,42.23 24.57,42.23 22.29,39.94
A0  (via drill 0.3)
  Top 0.254: U5.36 26.01,41.76 26.91,42.66 U1.36
  Top 0.305: v29.46,44.58 29.08,44.96 27.43,44.96 26.91,44.44 U1.36
  Bottom 0.305: v29.46,44.58 30.23,43.81 30.23,33.27 32.13,31.37 32.13,19.56 49.15,2.54 JP6.1
A1  (via drill 0.3)
  Top 0.254: U5.37 25.51,42.02 26.11,42.62 U1.37
  Top 0.305: v30.48,44.58 29.59,45.47 27.18,45.47 26.11,44.4 U1.37
  Bottom 0.305: JP6.2 51.56,4.32 48.26,4.32 32.89,19.69 32.89,31.5 30.86,33.53 30.86,44.2 v30.48,44.58
A2  (via drill 0.3)
  Top 0.254: U5.38 25.01,42.28 25.31,42.58 U1.38
  Top 0.305: v31.5,44.58 30.1,45.97 26.67,45.97 25.31,44.61 U1.38
  Bottom 0.305: JP6.3 53.34,5.08 48.26,5.08 33.66,19.69 33.66,31.62 31.5,33.78 v31.5,44.58
A3  (via drill 0.3)
  Top 0.254: U5.39 U1.39
  Top 0.305: v32.51,44.58 30.61,46.48 26.42,46.48 24.51,44.58 U1.39
  Bottom 0.305: JP6.4 55.12,5.84 48.26,5.84 34.42,19.69 34.42,31.75 32.13,34.04 32.13,44.2 v32.51,44.58
A4  (via drill 0.3)
  Top 0.254: U5.40 24.01,42.54 23.71,42.84 U1.40
  Top 0.305: v33.53,44.58 31.12,46.99 26.16,46.99 23.71,44.54 U1.40
  Bottom 0.305: JP6.5 56.9,6.6 48.26,6.6 35.18,19.69 35.18,31.88 32.77,34.29 32.77,43.81 v33.53,44.58
A5  (via drill 0.3)
  Top 0.254: U5.41 23.51,42.15 22.91,42.75 U1.41
  Top 0.305: v34.54,44.58 31.62,47.5 25.91,47.5 22.91,44.5 U1.41
  Bottom 0.305: JP6.6 58.67,7.37 48.26,7.37 35.94,19.69 35.94,32 33.4,34.54 33.4,43.43 v34.54,44.58
AREF
  Top 0.254: U5.42 23.01,41.89 22.11,42.79 U1.42
  Top 0.305: U1.42 22.11,44.59 23.62,46.1 23.62,49.02 | C22.1 16.63,49.02 23.62,49.02 | JP3.8 23.88,49.28 23.62,49.02
AVCC  (via drill 0.3)
  Top 0.254: U5.44 20.51,42.62 U1.44 | U5.24 28.16,35.85 29.36,34.65 U1.24
  Top 0.305: U1.24 34.39,34.65 v34.42,34.67 | v20.83,45.09 20.51,44.77 U1.44 20.32,43.84 L1.2
  Top 0.5: C19.1 13.7,43.84 L1.2
  Bottom 0.305: v34.42,34.67 34.04,35.05 34.04,41.4 35.18,42.55 35.18,45.21 34.42,45.97 28.7,45.97 27.81,45.09 v20.83,45.09
B1
  Top 0.406: 13.A 57.42,43.12 RP1.8
CON1
  Top 0.61: C24.2 C26.1
  Top 0.813: X1.1 44.17,19.94 L2.1 42,19.66 C24.2
  pour Top (isolate 0.406, no thermals): 45.15,17.02 41.47,17.02 41.47,18.8 41.08,19.18 41.08,20.51 43.75,20.51 44.07,20.95 45.78,20.95 45.78,19.62 45.15,18.99
D2  (via drill 0.3)
  Top 0.254: U5.19 25.51,33.67 26.11,33.07 U1.19
  Top 0.305: U1.19 26.11,30.66 v26.54,30.23
  Top 0.406: JP2.3 54.67,47.05 49.21,47.05 34.48,32.32 30.16,32.32 v30.04,32.19
  Bottom 0.406: v30.04,32.19 27.24,32.19 26.54,31.5 v26.54,30.23
D3  (via drill 0.3)
  Top 0.254: U5.18 25.01,33.41 25.31,33.11 U1.18
  Top 0.305: U1.18 25.31,30.44 v25.53,30.23
  Top 0.406: JP2.4 52.9,47.82 48.7,47.82 33.97,33.08 29.53,33.08 v29.4,32.96
  Bottom 0.406: v29.4,32.96 26.61,32.96 25.53,31.88 v25.53,30.23 23.43,30.23 22.54,29.34 20.89,29.34 20.26,29.97 18.73,29.97 17.97,30.73 17.97,34.99 17.34,35.62 17.34,42.37 JP1.1
D4
  Top 0.254: U5.25 28.42,36.35 29.32,35.45 U1.25
  Top 0.406: U1.25 35.07,35.45 48.13,48.51 51.82,48.51 53.34,50.04 JP2.5
D5  (via drill 0.3)
  Top 0.254: U5.31 28.42,39.35 29.32,40.25 U1.31
  Top 0.406: U1.31 33.77,40.25 38.1,44.58 v38.23,44.58
  Bottom 0.406: JP2.6 50.8,49.15 46.23,44.58 v38.23,44.58
D6
  Top 0.254: U5.27 28.95,37.35 29.25,37.05 U1.27
  Top 0.406: U1.27 35.52,37.05 48.26,49.78 JP2.7
D7  (via drill 0.3)
  Top 0.254: U5.1 19.74,41.85 U1.1
  Top 0.406: v19.56,42.93 18.71,42.08 U1.1
  Bottom 0.406: JP2.8 43.69,48.77 33.53,48.77 32.26,47.5 27.69,47.5 26.92,46.74 20.19,46.74 19.05,45.59 19.05,43.94 19.56,43.43 v19.56,42.93
D8
  Top 0.254: U1.28 U5.28
  Top 0.406: U1.28 35.18,37.85 42.54,45.21 42.54,49.91 JP3.1
D9
  Top 0.254: U5.29 28.95,38.35 29.25,38.65 U1.29
  Top 0.406: U1.29 34.71,38.65 41.28,45.21 41.28,48.64 JP3.2
D10
  Top 0.254: U5.30 28.69,38.85 29.29,39.45 U1.30
  Top 0.406: U1.30 34.24,39.45 40.39,45.59 40.39,46.99 JP3.3
D11  (via drill 0.3)
  Top 0.254: U5.12 20.51,33.07 U1.12
  Top 0.305: v19.56,31.75 19.85,32.05 U1.12
  Bottom 0.406: JP3.4 31.5,48.26 27.18,48.26 26.42,47.5 19.81,47.5 18.29,45.97 18.29,43.43 18.8,42.93 18.8,36.32 19.62,35.5 19.62,31.81 v19.56,31.75
D12  (via drill 0.3)
  Top 0.254: U5.26 28.69,36.85 29.29,36.25 U1.26
  Top 0.406: v34.67,36.2 34.6,36.25 U1.26 | JP3.5 v36.45,45.85
  Bottom 0.305: v34.67,36.2 34.67,41.02 35.81,42.16 35.81,45.09 v36.45,45.85
D13  (via drill 0.3, 0.4)
  Top 0.254: U5.32 28.16,39.85 29.36,41.05 U1.32
  Top 0.406: U1.32 33.3,41.05 36.58,44.32 v36.58,44.58 32.26,48.89 30.23,48.89 28.96,50.17 JP3.6 | RP1.1 52.13,43.12 50.55,41.53 v48.96,41.53
  Bottom 0.406: v36.58,44.58 36.58,42.67 37.72,41.53 v48.96,41.53
D14(MISO)  (via drill 0.3)
  Top 0.254: U5.11 19.74,33.85 U1.11
  Top 0.406: 18.48,33.85 U1.11 18.35,33.85 16.26,31.75 v14.48,31.75 | JP2.1 58.1,45.4 50.1,45.4 39.05,34.35 39.05,33.21 35.88,30.04 29.78,30.04 v29.27,29.53
  Bottom 0.406: ICSP.1 10.16,47 10.16,43.94 13.34,40.77 13.34,32.89 v14.48,31.75 14.48,29.21 17.08,26.61 22.29,26.61 24.07,28.38 28.13,28.38 v29.27,29.53
D15(SCK)  (via drill 0.3)
  Top 0.254: U5.9 20.6,36.35 19.7,35.45 U1.9
  Top 0.406: U1.9 17.41,35.45 v16.51,34.54 15.24,34.54 13.65,32.96 13.65,28.13 v12.89,27.37 | T3.3 15.18,21.06 15.18,19.11 14.44,18.38 R4.1 13.53,19.11 13.27,19.37 v12.89,19.37
  Bottom 0.406: ICSP.3 12.7,47 12.7,45.21 16.51,41.4 v16.51,34.54 | v12.89,19.37 v12.89,27.37
D16(MOSI)  (via drill 0.3)
  Top 0.254: U5.10 20.86,35.85 19.66,34.65 U1.10
  Top 0.406: ICSP.4 12.7,49.54 12.7,44.7 11.94,43.94 v11.43,43.94 | U1.10 17.88,34.65 15.88,32.64 v14.99,32.64 | JP2.2 56.45,46.29 49.72,46.29 38.16,34.73 38.16,33.59 35.37,30.8 29.4,30.8 v29.27,30.67
  Bottom 0.406: v11.43,43.94 14.1,41.28 14.1,33.4 14.86,32.64 v14.99,32.64 15.3,32.32 15.3,29.53 17.46,27.37 21.91,27.37 23.69,29.15 27.75,29.15 v29.27,30.67
G1
  Top 0.406: RX.C 57.28,40.72 RP1.5
GND  (via drill 0.3, 0.5)
  Top 0.254: U1.15 22.91,33.07 23.51,33.67 U5.15 23.51,36.85 U1.P$1 | U1.23 29.29,33.85 U5.23 27.01,35.35 U1.P$1 | U1.5 19.77,38.65 20.07,38.35 U5.5 24.01,38.35 U1.P$1 | U1.43 21.31,42.82 22.51,41.62 U5.43 22.51,39.85 U1.P$1 | U1.35 27.71,42.7 26.51,41.5 U5.35 26.51,39.85 U1.P$1 | U4.3 34.48,20.59 | 34.48,20.59 34.27,20.59 U4.TP | U4.7 33.77,22.59 U4.TP | U4.17 32.27,22.59 U4.TP | U4.18 U4.17 | U4.11 35.76,24.83 v36.96,26.03 | U4.1 35.48,19.59 34.48,20.59 | U4.17 U4.16
  Top 0.305: Y3.2 19.46,28.99
  Top 0.406: C11.1 29.68,28.92 29.34,28.58 v29.34,27.94 | Y3.2 22.09,29.46 22.92,30.29 22.92,32.03 U1.15 | 9.14,36.83 13.21,36.83 15.02,38.65 U1.5 | C8.2 26.34,13.42 24.08,13.42 23.94,13.53 23.69,13.53 23.66,13.55 C9.1 | U2.2 v10.16,21.4 | v16.51,18.92 15.94,18.35 15.94,14.29 15.56,13.91 14.8,13.91 13.97,14.73 v13.97,15.11 | v17.78,22.48 17.46,22.16 17.46,21.4 16.52,20.46 T3.2 | 19.3,29.08 19.3,27.37 | RP1.2 52.35,42.32 50.63,40.6 48.54,40.6
  Top 0.5: C7.1 C31.2 | C20.1 C21.1 C14.1 30.63,14.39 C8.2 | J1.1 9.02,36.83 | 10.03,35.81 C23.2 C5.1
  Top 0.61: U$1.GND v48.64,21.84 | C7.1 23.26,14.39 C9.1
  Top 1: C3.- 2.11,26.91 IC1.1
  Bottom 0.406: 31.37,20.19 31.37,19.18 33.46,17.08 33.46,16.07 33.02,15.62 C21.1
  other vias: 38.1,47.5 17.78,1.78 5.08,1.78 5.08,4.32 2.54,4.32 2.54,1.78 2.54,6.86 2.54,9.4 2.54,11.94 5.08,11.94 7.62,11.94 7.62,52.58 10.16,52.58 12.7,52.58 15.24,52.58 1.27,44.96 24.51,37.85 25.78,39.12 25.78,36.58 23.24,36.58 23.24,39.12 24.51,39.12 25.78,37.85 23.24,37.85 24.51,36.58 31.37,23.5 31.37,21.84 23.5,25.91 9.27,42.29 39.62,27.31 43.69,47.5 28.96,14.35 46.99,34.8 46.99,32.26 46.99,29.72 45.72,30.99 46.99,30.99 44.45,34.8 44.45,33.53 44.45,32.26 44.45,30.99 44.45,29.72 44.45,28.45 45.72,33.53 45.72,32.26 45.72,29.72 45.72,28.45 46.99,28.45 46.99,33.53 57.15,37.34 55.88,37.34 54.61,37.34 50.8,37.34 53.34,37.34 52.07,37.34 45.72,34.8 45.72,36.07 46.99,36.07 49.53,37.34 48.26,37.34 46.99,37.34 45.72,37.34 44.45,36.07 58.42,37.34 59.69,37.34 60.96,37.34 62.23,37.34 63.5,37.34 63.5,38.61 64.77,38.61 62.23,38.61 60.96,38.61 63.5,39.88 64.77,39.88 46.99,15.24 45.72,15.24 44.45,15.24 44.45,13.97 45.72,13.97 46.99,13.97 46.99,12.7 45.72,12.7 44.45,12.7 45.72,11.43 46.99,11.43 46.99,10.16 64.77,6.86 66.04,6.86 67.31,6.86 67.31,5.59 66.04,5.59 1.52,25.15 23.5,8.13 9.91,18.16 24.76,25.91 4.06,38.61 2.03,38.61 39.88,10.16 40.77,21.97 38.73,22.22 31.37,20.32 19.43,8.13 18.41,48.01 3.05,25.15 15.37,13.84 20.19,25.4 13.97,27.05 12.45,28.32 47.5,21.84 18.8,9.4
  pour Bottom (isolate 0.406, rank 3, no thermals): 0,53.47 68.58,53.47 68.58,-0.76 0,-0.76
  pour Top (isolate 0.406, rank 2, no thermals): 0,57.4 68.58,57.4 68.58,-0.76 0,-0.76
  pour Top (isolate 0.406, no thermals): 49.34,22.16 49.21,22.16 48.26,23.11 48.13,23.24 46.8,23.24 46.8,20.45 48.13,20.45 49.21,21.53 49.34,21.53
HSU_RX/3.3V
  Top 0.254: U3.5 28.26,21.52 28.69,21.09 U4.27
HSU_TX/3.3V
  Top 0.254: U3.4 28.15,20.87 28.43,20.59 U4.28
HWB  (via drill 0.3)
  Top 0.254: U5.33 29.29,41.85 U1.33
  Top 0.305: 16.33,45.52 R10.1 16.4,45.59 17.4,45.59 20.07,48.26 v21.84,48.26 | U1.33 32.96,41.85 35.31,44.2 35.31,44.83 32,48.13 25.02,48.13 v24.89,48.26
  Bottom 0.305: v24.89,48.26 v21.84,48.26
IRQ/5V  (via drill 0.3)
  Top 0.305: U3.14 21,22.82 18.54,25.27 v18.54,28.19
  Bottom 0.406: JP1.2 11.44,45.2 14.86,41.78 14.86,33.91 16,32.77 16,29.97 17.78,28.19 v18.54,28.19
IRQ_3.3V
  Top 0.254: U4.25 29.21,22.09 28.49,22.82 U3.7
N$1
  Top 0.5: T3.1 18.54,18.67 16.7,16.83 16.7,13.27 22.09,7.89 BUZZ.-
N$3  (via drill 0.5)
  Top 0.5: J1.5 8.79,40.03 v9.14,40.39
  Top 0.813: F1.1 2.29,31.05 v2.29,29.34
  Bottom 0.813: v2.29,29.34 4,31.05 6.54,31.05 9.14,33.66 v9.14,40.39
  pour Bottom (isolate 0.406, no thermals): 1.97,29.53 1.97,30.54 7.81,36.39 7.81,39.69 9.08,40.96 9.59,40.96 10.6,39.94 10.6,32.07 9.08,30.54 7.3,30.54 5.78,29.02 2.48,29.02
N$4  (1 unrouted)
  Top 0.8: J1.9 1.21,42.92 1.63,42.75 J1.8
  Top 0.813: R3.2 6.63,43.75 J1.8
  Top 1.016: J1.6 J1.7
N$8
  Top 0.813: C18.1 R6.1
N$9
  Top 0.254: U4.4 37.33,21.09 38.48,19.94 L2.2
N$10
  Top 0.254: U4.6 37.33,22.09 39.12,23.88 L3.2
N$11
  Top 0.406: ON.C 58.01,42.32 RP1.7
N$14
  Top 0.5: J1.4 9.26,39.23 9.91,39.88 R11.1
N$16
  Top 0.5: J1.3 9.32,38.43 9.91,37.85 R12.1
N$21
  Top 0.8: T1.2 5.25,14.68 C2.+
  Top 1: IC1.3 3.71,19.02 5.25,17.49 C2.+
N$23
  Top 0.305: U3.10 26.55,24.77 24.38,22.61 24.38,18.54 23.66,17.82 R2.2
N$47
  Top 0.254: U4.14 33.77,25.92 33.53,26.16 33.53,28.19 34.2,28.87 Y2.1
  Top 0.61: C15.2 34.68,28.92 Y2.1
N$48
  Top 0.254: U4.15 33.27,25.66 32.43,26.5 Y2.2
  Top 0.61: C11.2 32.38,27.22 Y2.2
N$49
  Top 0.254: U4.9 36.8,23.59 38.61,25.4 38.61,27.94 40.22,29.55 C17.2
  Top 0.813: R5.2 C17.2
N$50
  Top 0.254: R5.1 40.09,32.6 38.1,30.61 38.1,25.78 36.41,24.09 U4.10
  Top 0.813: R5.1 C18.2
R1
  Top 0.406: TX.C 58,41.52 RP1.6
RD+
  Top 0.254: U5.4 20.34,38.85 19.74,39.45 U1.4
  Top 0.406: U1.4 14.01,39.45 R12.2
RD-
  Top 0.254: U5.3 20.6,39.35 19.7,40.25 U1.3
  Top 0.406: U1.3 12.78,40.25 R11.2
RESET  (via drill 0.3, 0.5)
  Top 0.254: U5.13 22.51,34.2 21.31,33 U1.13
  Top 0.305: v19.56,30.73 20.57,30.73 21.31,31.47 U1.13
  Top 0.406: RST.2 1.7,49.45 v1.78,49.53 | v19.56,30.73 18.03,30.73 15.11,27.81 v15.11,25.91 | v25.08,9.97 25.08,5.4 27.94,2.54 JP4.1
  Top 0.813: RST.2 4.05,47.56 D2.A 5.53,47.83 R7.2
  Bottom 0.406: v1.78,49.53 12.71,49.53 ICSP.5 16.51,48.26 17.53,47.24 17.53,43.13 18.03,42.62 18.03,35.94 18.73,35.24 18.73,31.18 19.18,30.73 v19.56,30.73 | v25.08,9.97 20.51,14.54 17.08,14.54 15.11,16.51 v15.11,25.91
RSTOUT_N/3.3V
  Top 0.254: U4.26 28.95,21.59 28.38,22.17 U3.6
RSTOUT_N/5V  (via drill 0.3)
  Top 0.305: U3.15 20.76,22.17 17.91,25.02 v17.65,25.02
  Bottom 0.406: JP1.3 8.9,43.93 12.51,40.32 12.51,29.91 17.4,25.02 v17.65,25.02
RXD0
  Top 0.254: U5.20 26.01,33.93 26.91,33.03 U1.20
  Top 0.305: U3.17 22.77,20.87 23.81,21.91 23.81,22.92 27.62,26.73 27.62,30.16 26.91,30.87 U1.20
RXLED  (via drill 0.3, 0.4)
  Top 0.254: U5.8 20.08,36.85 v19.88,36.64 19.48,36.25 U1.8
  Top 0.406: v53.85,40.77 53.9,40.72 RP1.4
  Bottom 0.406: v53.85,40.77 52.2,42.42 37.97,42.42 37.34,43.05 37.34,46.23 36.7,46.74 28.19,46.74 27.43,45.97 20.45,45.97 19.81,45.34 19.81,44.45 20.32,43.94 20.32,42.42 19.56,41.66 19.56,36.96 v19.88,36.64
TX1_ANTENNA
  Top 0.61: C26.2 47.24,18.45 C29.2
  Top 0.813: C29.2 48.25,19.22 48.51,19.42 49.66,20.57 U$1.TX2
  pour Top (no thermals): 45.78,17.08 45.78,18.67 46.8,19.69 48.07,19.69 49.21,20.83 49.97,20.83 49.97,20.45 46.86,17.34
TX2_ANTENNA
  Top 0.61: C27.1 47.24,25.23 C30.1
  Top 0.813: U$1.TX1 48.51,24.47 C30.1
  pour Top (isolate 0.406, no thermals): 45.78,25.65 45.78,25.02 46.8,24 48.07,24 49.21,22.86 49.97,22.86 49.97,23.5 46.86,26.61 45.78,26.61
TXD1  (via drill 0.3)
  Top 0.254: U5.21 26.51,34.2 27.71,33 U1.21
  Top 0.305: v23.69,24.07 23.18,23.56 23.18,22.29 22.41,21.52 U3.16
  Top 0.406: U1.21 27.71,31.22 28.32,30.61 v28.32,26.54
  Bottom 0.406: v23.69,24.07 25.84,24.07 v28.32,26.54
TXLED  (via drill 0.3, 0.4)
  Top 0.254: U5.22 28.51,33.07 U1.22
  Top 0.305: 28.51,33.07 28.51,31.94
  Top 0.406: 28.51,31.94 28.96,31.5 34.8,31.5 v37.21,33.91 | v48.96,39.69 50.67,39.69 52.5,41.52 RP1.3
  Bottom 0.406: v48.96,39.69 37.27,39.69 36.51,38.93 36.51,34.61 v37.21,33.91
UCAP
  Top 0.254: U1.6 U5.6
  Top 0.406: U1.6 15.37,37.85 13.34,35.81 C23.1
VIN  (via drill 0.5)
  Top 0.5: T2.3 7.55,28.38 v8.64,29.46
  Top 0.8: T1.1 10.72,15.65 R1.2
  Top 0.813: 11.75,8.88 EXTPOWER.2 11.86,8.81
  Top 1: R1.2 11.75,8.88
  Top 1.27: 11.86,8.81 12.93,9.88 D1.C
  Bottom 0.6: v8.64,29.46 11.81,26.29 EXTPOWER.2
  Bottom 1.016: JP4.6 45.66,2.6 45.66,3.62 43.88,5.4 31.94,5.4 29.65,3.11 20,3.11 14.3,8.81 EXTPOWER.2
  pour Top (isolate 0.61, no thermals): 9.84,8.06 9.08,8.83 9.08,16.07 10.1,17.08 12.13,17.08 12.26,16.95 12.26,14.92 17.46,9.72 17.46,8.7 15.3,8.7 14.67,8.06
  pour Bottom (isolate 0.61, no thermals): 11.11,6.92 11.11,22.67 6.54,27.24 6.54,28.51 7.81,29.78 9.33,29.78 12.89,26.23 12.89,11.75 20,4.64 29.4,4.64 32.19,7.43 43.62,7.43 47.18,3.87 47.18,1.59 44.89,1.59 44.89,3.37 43.88,4.38 32.45,4.38 30.16,2.1 19.49,2.1 15.43,6.16 11.87,6.16
VUSB
  Top 0.254: U5.7 19.57,37.35 19.27,37.05 U1.7
  Top 0.406: U1.7 15.71,37.05 12.45,33.78 C5.2
  Top 0.5: T2.1 9.82,27.09 12.7,29.97 12.7,31.11 | 12.7,31.11 12.7,33.48 12.71,33.48 | F1.2 12.7,31.11
  pour Top (isolate 0.406, no thermals): 4.76,31.56 5.14,31.94 10.73,31.94 11.87,33.08 11.87,33.85 12.89,33.85 12.89,29.78 9.84,26.73 9.33,26.73 9.33,30.04 9.08,30.29 5.02,30.29 4.76,30.54
XTAL1
  Top 0.254: U5.17 U1.17
  Top 0.406: U1.17 24.51,29.11 Y3.1 | 24.6,28.99 Y3.1 | Y3.1 24.47,28.92 C12.2
XTAL2
  Top 0.254: U5.16 24.01,33.41 23.71,33.11 U1.16
  Top 0.406: U1.16 23.71,30.19 23.24,29.72 23.24,28.07 22.32,27.14 Y3.3 22.02,27.22 C1.2
XX1
  Top 0.61: C25.1 C27.2
  Top 0.813: X1.3 41.72,23.31 L3.1 42,24.16 C25.1 42.42,26.58 R6.2
  pour Top (isolate 0.406, no thermals): 41.08,23.11 41.08,24.57 41.47,24.96 41.47,26.61 41.91,27.05 41.91,28.32 42.93,28.32 44.64,26.61 45.15,26.61 45.15,25.72 44.51,25.72 43.05,24.26 43.05,21.4 42.8,21.4

### Text on the board
tPlace: AREF | GND | D13 | D12 | D11 | D10 | D09 | D08 | D07 | D06 | D05 | D04 | D03 | D02 | D16 | D14 | DIGITALS | DIGITALS | OPEN SOURCE / HARDWARE | POWER | INPUTS | RST | 3V3 | +5V | GND | GND | VIN | A0 | A1 | A2 | A3 | A4 | A5 | D15
bPlace: NORMAL V5.1 | KeyDuino | Designed by Pierre CHARLIER | In collaboration with the CITC EURARFID | & in partnership with NFC RING